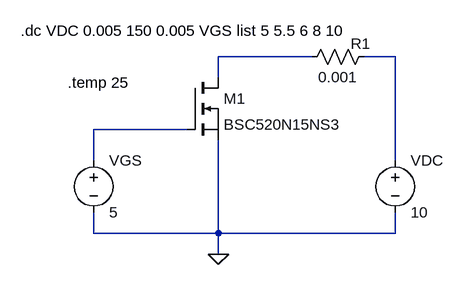
[diagram p0: schematic Drain-source on resistance.asc]
Drain-source on resistance.asc, the LTspice schematic file:
Version 4
SHEET 1 880 680
WIRE 304 32 160 32
WIRE 432 32 384 32
WIRE 160 64 160 32
WIRE 112 144 -32 144
WIRE -32 192 -32 144
WIRE 432 192 432 32
WIRE -32 304 -32 272
WIRE 160 304 160 160
WIRE 160 304 -32 304
WIRE 432 304 432 272
WIRE 432 304 160 304
WIRE 160 336 160 304
FLAG 160 336 0
SYMBOL nmos 112 64 R0
SYMATTR InstName M1
SYMATTR Value BSC520N15NS3
SYMBOL voltage -32 176 R0
WINDOW 123 0 0 Left 2
WINDOW 39 0 0 Left 2
SYMATTR InstName VGS
SYMATTR Value 5
SYMBOL voltage 432 176 R0
WINDOW 123 0 0 Left 2
WINDOW 39 0 0 Left 2
SYMATTR InstName VDC
SYMATTR Value 10
SYMBOL res 400 16 R90
WINDOW 0 11 21 VBottom 2
WINDOW 3 32 56 VTop 2
SYMATTR InstName R1
SYMATTR Value 0.001
TEXT -144 -8 Left 2 !.dc VDC 0.005 150 0.005 VGS list 5 5.5 6 8 10
TEXT -72 72 Left 2 !.temp 25

The netlist it stands for:
* Drain-source on resistance.asc
M1 N001 N003 0 0 BSC520N15NS3
VGS N003 0 5
VDC N002 0 10
R1 N002 N001 0.001
.model NMOS NMOS
.model PMOS PMOS
.lib standard.mos
.dc VDC 0.005 150 0.005 VGS list 5 5.5 6 8 10
.temp 25
.backanno
.end